# Altium project Board Tiva.PrjPcb
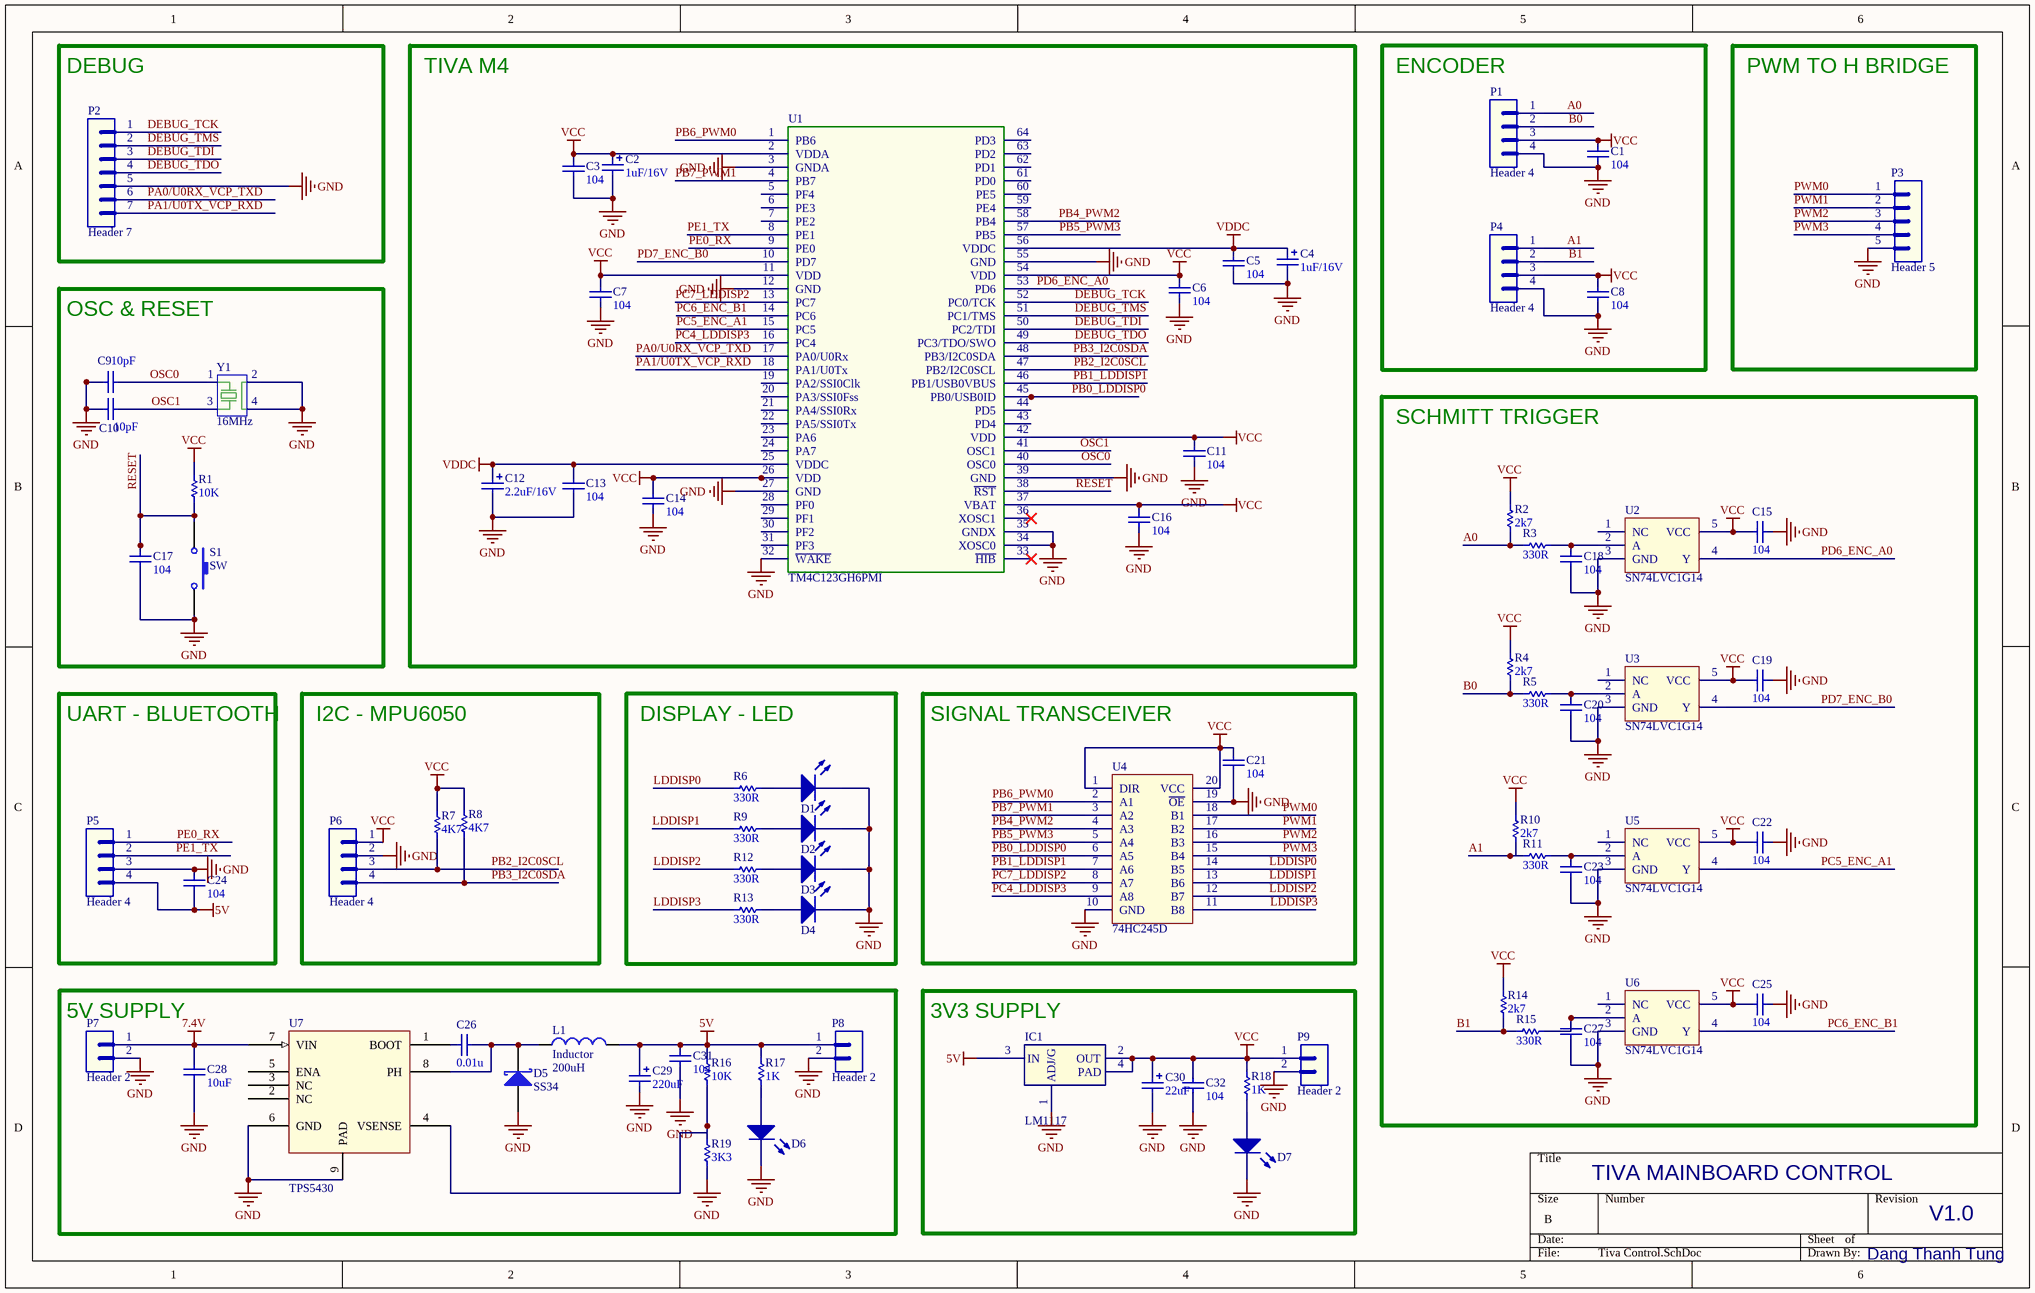
[diagram p0: Tiva Control.SchDoc]
1 sheet, 78 parts. Net scope: global (net labels, ports and power ports of the same name join across sheets).
Board file: Tiva Control PCB.PcbDoc

## Sheet Tiva Control.SchDoc: TIVA MAINBOARD CONTROL
size B; Date: 20/08/2017; DrawnBy: Dang Thanh Tung; Engineer: Dang Thanh Tung

### Parts
C1  value 104  [CAP-SM-0805]  (hidden comment: Cap Non-Pol SMD)
C2  Capacitance: 1uF/16V  [CAP TANTALUM SMD-1206]  (hidden comment: Capacitors)
C3  value 104  [CAP-SM-0805]  (hidden comment: Cap Non-Pol SMD)
C4  Capacitance: 1uF/16V  [CAP TANTALUM SMD-1206]  (hidden comment: Capacitors)
C5  value 104  [CAP-SM-0805]  (hidden comment: Cap Non-Pol SMD)
C6  value 104  [CAP-SM-0805]  (hidden comment: Cap Non-Pol SMD)
C7  value 104  [CAP-SM-0805]  (hidden comment: Cap Non-Pol SMD)
C8  value 104  [CAP-SM-0805]  (hidden comment: Cap Non-Pol SMD)
C9  value 10pF  [CAP-SM-0805]  (hidden comment: Cap Non-Pol SMD)
C10  value 10pF  [CAP-SM-0805]  (hidden comment: Cap Non-Pol SMD)
C11  value 104  [CAP-SM-0805]  (hidden comment: Cap Non-Pol SMD)
C12  Capacitance: 2.2uF/16V  [CAP TANTALUM SMD-1206]  (hidden comment: Capacitors)
C13  value 104  [CAP-SM-0805]  (hidden comment: Cap Non-Pol SMD)
C14  value 104  [CAP-SM-0805]  (hidden comment: Cap Non-Pol SMD)
C15  value 104  [CAP-SM-0805]  (hidden comment: Cap Non-Pol SMD)
C16  value 104  [CAP-SM-0805]  (hidden comment: Cap Non-Pol SMD)
C17  value 104  [CAP-SM-0805]  (hidden comment: Cap Non-Pol SMD)
C18  value 104  [CAP-SM-0805]  (hidden comment: Cap Non-Pol SMD)
C19  value 104  [CAP-SM-0805]  (hidden comment: Cap Non-Pol SMD)
C20  value 104  [CAP-SM-0805]  (hidden comment: Cap Non-Pol SMD)
C21  value 104  [CAP-SM-0805]  (hidden comment: Cap Non-Pol SMD)
C22  value 104  [CAP-SM-0805]  (hidden comment: Cap Non-Pol SMD)
C23  value 104  [CAP-SM-0805]  (hidden comment: Cap Non-Pol SMD)
C24  value 104  [CAP-SM-0805]  (hidden comment: Cap Non-Pol SMD)
C25  value 104  [CAP-SM-0805]  (hidden comment: Cap Non-Pol SMD)
C26  value 0.01u  [CAP-SM-0805]  (hidden comment: Cap Non-Pol SMD)
C27  value 104  [CAP-SM-0805]  (hidden comment: Cap Non-Pol SMD)
C28  value 10uF  [CAP-SM-0805]  (hidden comment: Cap Non-Pol SMD)
C29  value 220uF  [CAP ALU SIZE D]  (hidden comment: Cap Pol SMD)
C30  value 22uF  [CAP ALU SIZE B]  (hidden comment: Cap Pol SMD)
C31  value 104  [CAP-SM-0805]  (hidden comment: Cap Non-Pol SMD)
C32  value 104  [CAP-SM-0805]  (hidden comment: Cap Non-Pol SMD)
D1  LED SMD  [LED_0805_Blue]  (value not drawn)
D2  LED SMD  [LED_0805_Blue]  (value not drawn)
D3  LED SMD  [LED_0805_Blue]  (value not drawn)
D4  LED SMD  [LED_0805_Blue]  (value not drawn)
D5  SS34  [SS34]
D6  LED SMD  [LED_0805_Blue]  (value not drawn)
D7  LED SMD  [LED_0805_Blue]  (value not drawn)
IC1  LM1117  [SOT223-4N]
L1  Inductor  value 200uH  [INDUCTOR 12.5x12.5]
P1  Header 4  [JP4]
P2  Header 7  [JP7]
P3  Header 5  [JP5]
P4  Header 4  [JP4]
P5  Header 4  [JP4]
P6  Header 4  [JP4]
P7  Header 2  [JP2]
P8  Header 2  [JP2]
P9  Header 2  [JP2]
R1  value 10K  [RES-SM-0805]  (hidden comment: Res SMD)
R2  value 2k7  [RES-SM-0805]  (hidden comment: Res SMD)
R3  value 330R  [RES-SM-0805]  (hidden comment: Res SMD)
R4  value 2k7  [RES-SM-0805]  (hidden comment: Res SMD)
R5  value 330R  [RES-SM-0805]  (hidden comment: Res SMD)
R6  value 330R  [RES-SM-0805]  (hidden comment: Res SMD)
R7  value 4K7  [RES-SM-0805]  (hidden comment: Res SMD)
R8  value 4K7  [RES-SM-0805]  (hidden comment: Res SMD)
R9  value 330R  [RES-SM-0805]  (hidden comment: Res SMD)
R10  value 2k7  [RES-SM-0805]  (hidden comment: Res SMD)
R11  value 330R  [RES-SM-0805]  (hidden comment: Res SMD)
R12  value 330R  [RES-SM-0805]  (hidden comment: Res SMD)
R13  value 330R  [RES-SM-0805]  (hidden comment: Res SMD)
R14  value 2k7  [RES-SM-0805]  (hidden comment: Res SMD)
R15  value 330R  [RES-SM-0805]  (hidden comment: Res SMD)
R16  value 10K  [RES-SM-0805]  (hidden comment: Res SMD)
R17  value 1K  [RES-SM-0805]  (hidden comment: Res SMD)
R18  value 1K  [RES-SM-0805]  (hidden comment: Res SMD)
R19  value 3K3  [RES-SM-0805]  (hidden comment: Res SMD)
S1  SW  [SW-SMD]
U1  TM4C123GH6PMI  [S-PQFP-G64]
U2  SN74LVC1G14  [SOT23-5N]
U3  SN74LVC1G14  [SOT23-5N]
U4  74HC245D  [SOIC127P1030X265-20M]
U5  SN74LVC1G14  [SOT23-5N]
U6  SN74LVC1G14  [SOT23-5N]
U7  TPS5430  [DDA8]
Y1  16MHz  [Crystal SMD 2.5X2.0]

### Blocks framed on the sheet
DEBUG: P2
TIVA M4: C2-C7 C11-C14 C16 U1
ENCODER: C1 C8 P1 P4
PWM TO H BRIDGE: P3
OSC & RESET: C9 C10 C17 R1 S1 Y1
SCHMITT TRIGGER: C15 C18-C20 C22 C23 C25 C27 R2-R5 R10 R11 R14 R15 U2 U3 U5 U6
UART - BLUETOOTH: C24 P5
I2C - MPU6050: P6 R7 R8
DISPLAY - LED: D1-D4 R6 R9 R12 R13
SIGNAL TRANSCEIVER: C21 U4
5V SUPPLY: C26 C28 C29 C31 D5 D6 L1 P7 P8 R16 R17 R19 U7
3V3 SUPPLY: C30 C32 D7 IC1 P9 R18

### Nets
5V: C24.2 C29.1 C31.1 IC1.3(IN) L1.2 P5.4 P8.1 R16.2 R17.2
7.4V: C28.2 P7.1 U7.7(VIN)
GND: C1.2 C2.2 C3.2 C4.2 C5.2 C6.2 C7.2 C8.2 C9.1 C10.1 C11.2 C12.2 C13.2 C14.2 C15.2 C16.2 C17.2 C18.1 C19.2 C20.1 C21.2 C22.2 C23.1 C24.1 C25.2 C27.1 C28.1 C29.2 C30.2 C31.2 C32.2 D1.2(K) D2.2(K) D3.2(K) D4.2(K) D5.1(A) D6.2(K) D7.2(K) IC1.1(ADJ/G) P1.4 P2.5 P3.5 P4.4 P5.3 P6.2 P7.2 P8.2 P9.2 R19.1 S1.2 U1.3(GNDA) U1.12(GND) U1.27(GND) U1.32(~{WAKE}) U1.34(XOSC0) U1.35(GNDX) U1.39(GND) U1.55(GND) U2.3(GND) U3.3(GND) U4.10(GND) U4.19(~{OE}) U5.3(GND) U6.3(GND) U7.6(GND) U7.9(PAD) Y1.2 Y1.4
VCC: C1.1 C2.1 C3.1 C6.1 C7.1 C8.1 C11.1 C14.1 C15.1 C16.1 C19.1 C21.1 C22.1 C25.1 C30.1 C32.1 IC1.2(OUT) IC1.4(PAD) P1.3 P4.3 P6.1 P9.1 R1.2 R2.2 R4.2 R7.2 R8.2 R10.2 R14.2 R18.2 U1.2(VDDA) U1.11(VDD) U1.26(VDD) U1.37(VBAT) U1.42(VDD) U1.54(VDD) U2.5(VCC) U3.5(VCC) U4.1(DIR) U4.20(VCC) U5.5(VCC) U6.5(VCC)
VDDC: C4.1 C5.1 C12.1 C13.1 U1.25(VDDC) U1.56(VDDC)
A0: P1.1 R2.1 R3.1
A1: P4.1 R10.1 R11.1
B0: P1.2 R4.1 R5.1
B1: P4.2 R14.1 R15.1
DEBUG_TCK: P2.1 U1.52(PC0/TCK)
DEBUG_TDI: P2.3 U1.50(PC2/TDI)
DEBUG_TDO: P2.4 U1.49(PC3/TDO/SWO)
DEBUG_TMS: P2.2 U1.51(PC1/TMS)
LDDISP0: R6.1 U4.14(B5)
LDDISP1: R9.1 U4.13(B6)
LDDISP2: R12.1 U4.12(B7)
LDDISP3: R13.1 U4.11(B8)
OSC0: C9.2 U1.40(OSC0) Y1.1
OSC1: C10.2 U1.41(OSC1) Y1.3
PA0/U0RX_VCP_TXD: P2.6 U1.17(PA0/U0Rx)
PA1/U0TX_VCP_RXD: P2.7 U1.18(PA1/U0Tx)
PB0_LDDISP0: U1.45(PB0/USB0ID) U4.6(A5)
PB1_LDDISP1: U1.46(PB1/USB0VBUS) U4.7(A6)
PB2_I2C0SCL: P6.3 R7.1 U1.47(PB2/I2C0SCL)
PB3_I2C0SDA: P6.4 R8.1 U1.48(PB3/I2C0SDA)
PB4_PWM2: U1.58(PB4) U4.4(A3)
PB5_PWM3: U1.57(PB5) U4.5(A4)
PB6_PWM0: U1.1(PB6) U4.2(A1)
PB7_PWM1: U1.4(PB7) U4.3(A2)
PC4_LDDISP3: U1.16(PC4) U4.9(A8)
PC5_ENC_A1: U1.15(PC5) U5.4(Y)
PC6_ENC_B1: U1.14(PC6) U6.4(Y)
PC7_LDDISP2: U1.13(PC7) U4.8(A7)
PD6_ENC_A0: U1.53(PD6) U2.4(Y)
PD7_ENC_B0: U1.10(PD7) U3.4(Y)
PE0_RX: P5.1 U1.9(PE0)
PE1_TX: P5.2 U1.8(PE1)
PWM0: P3.1 U4.18(B1)
PWM1: P3.2 U4.17(B2)
PWM2: P3.3 U4.16(B3)
PWM3: P3.4 U4.15(B4)
RESET: C17.1 R1.1 S1.1 U1.38(~{RST})
NetC18_2: C18.2 R3.2 U2.2(A)
NetC20_2: C20.2 R5.2 U3.2(A)
NetC23_2: C23.2 R11.2 U5.2(A)
NetC26_1: C26.1 U7.1(BOOT)
NetC26_2: C26.2 D5.2(K) L1.1 U7.8(PH)
NetC27_2: C27.2 R15.2 U6.2(A)
NetD1_1: D1.1(A) R6.2
NetD2_1: D2.1(A) R9.2
NetD3_1: D3.1(A) R12.2
NetD4_1: D4.1(A) R13.2
NetD6_1: D6.1(A) R17.1
NetD7_1: D7.1(A) R18.1
NetR16_1: R16.1 R19.2 U7.4(VSENSE)

Not connected (* = marked no-connect by the designer): U1 5(PF4) 6(PE3) 7(PE2) 19(PA2/SSI0Clk) 20(PA3/SSI0Fss) 21(PA4/SSI0Rx) 22(PA5/SSI0Tx) 23(PA6) 24(PA7) 28(PF0) 29(PF1) 30(PF2) 31(PF3) 33(~{HIB})* 36(XOSC1)* 43(PD4) 44(PD5) 59(PE4) 60(PE5) 61(PD0) 62(PD1) 63(PD2) 64(PD3); U2 1(NC); U3 1(NC); U5 1(NC); U6 1(NC); U7 2(NC) 3(NC) 5(ENA)

### Notes on the sheet
- TIVA MAINBOARD CONTROL
- V1.0
- Dang Thanh Tung

### Library data of the parts
C1 C3 C5-C11 C13-C28 C31 C32 = Cap Non-Pol SMD: Capacitor
C2 C4 C12 = Cap Pol Tantalum: Capacitors Tantalum; Manufacturer: Kemet; Manufacturer Part Number: T491A106K010AT; Manufacturer Size Code: A; Tolerance: ±10%; Voltage - Rated: 10V; ESR (Equivalent Series Resistance): 3.8 Ohm; Type: Molded; Lifetime @ Temp.: 2000 Hrs @ 85°C; Supplier 1: Digi-Key; RoHS: RoHS Compliant; Category: Capacitors; Stock 1: 316000; Pricing 1: 2000=0.0626, 4000=0.05791, 10000=0.05478, 14000=0.05196, 50000=0.04695, 100000=0.04147 (USD); Packaging: Tape & Reel (TR); Part Status: Active; Operating Temperature: -55°C ~ 125°C; Mounting Type: Surface Mount; Package / Case: 1206 (3216 Metric); Size / Dimension: 0.126" L x 0.063" W (3.20mm x 1.60mm); Height - Seated (Max): 0.071" (1.80mm); Lead Spacing: -; Features: General Purpose; ComponentLink1URL: http://www.kemet.com/Lists/ProductCatalog/Attachments/254/KEM_T2005_T491.pdf; ComponentLink1Description: http://www.kemet.com/Lists/ProductCatalog/Attachments/254/KEM_T2005_T491.pdf
C29 C30 = Cap Pol SMD: Polarized Capacitor (Radial)
D1-D4 D6 D7 = LED SMD: LED
D5 = D Schottky: Schottky Diode; Published: 8-Jun-2000; LatestRevisionDate: 17-Jul-2002; LatestRevisionNote: Re-released for DXP Platform.; PackageReference: SMB; Publisher: Altium Limited; PackageDescription: DO-214-AA/SMB; 2 C-Bend Leads; Body 5.3 x 3.6 mm, inc. leads (LxW); Code_JEDEC: DO-214-AA
IC1 = LM1117: Available in 1.8V, 2.5V, 2.85V, 3.3V, 5V, and  Adjustable Versions; Value: LM317
P1 P4-P6 = Header 4: Header, 4-Pin; LatestRevisionDate: 17-Jul-2002; LatestRevisionNote: Re-released for DXP Platform.; Publisher: Altium Limited
P2 = Header 7: Header, 7-Pin; LatestRevisionDate: 17-Jul-2002; LatestRevisionNote: Re-released for DXP Platform.; Publisher: Altium Limited
P3 = Header 5: Header, 5-Pin; LatestRevisionDate: 17-Jul-2002; LatestRevisionNote: Re-released for DXP Platform.; Publisher: Altium Limited
P7-P9 = Header 2: Header, 2-Pin; LatestRevisionDate: 17-Jul-2002; LatestRevisionNote: Re-released for DXP Platform.; Publisher: Altium Limited
R1-R19 = Res SMD: Resistor
S1 = Tact SW - 2Pin: Switch button 2 pin
U1 = TM4C123GH6PMI: TEXAS INSTRUMENTS - TM4C123GH6PMI - 32 Bit Microcontroller, Tiva, ARM Cortex-M4F, 80 MHz, 256 KB, 32 KB, 64, LQFP; Supplier 1: Newark; RoHS: YES; Stock 1: 135; Pricing 1: 1=11.85, 10=10.71, 25=9.91, 50=9.46, 100=8.86, 250=8.47, 500=7.72, 1000=6.23 (USD); ComponentLink1URL: http://www.farnell.com/datasheets/1826106.pdf; ComponentLink1Description: http://www.farnell.com/datasheets/1826106.pdf; Manufacturer: TEXAS INSTRUMENTS; Supplier Part Number 1: 67X4763
U7 = TPS5430: PMIC - Voltage Regulators - DC DC Switching Regulators; Manufacturer_Part_Number: tps5430-ep_dda_8; GENERIC_PART_NUMBER: TPS5430-EP; Vendor: Texas Instruments; PACKAGE_DESIGNATOR: DDA; PIN_COUNT: 8; FAMILY_NAME: STEP-DOWN REGULATOR; INDUSTRY_STD_PKG_TYPE: SO PowerPAD; Datasheet URL: http://www.ti.com/lit/gpn/TPS5430-EP; Manufacturer: Texas Instruments; RefDes: RefDes; Type: DEV; Value: Value
Y1 = XTAL 4Pin SMD: Crystal For all Crystal 2pin